# Altium schematic sheet 温度控制.SchDoc
size A3
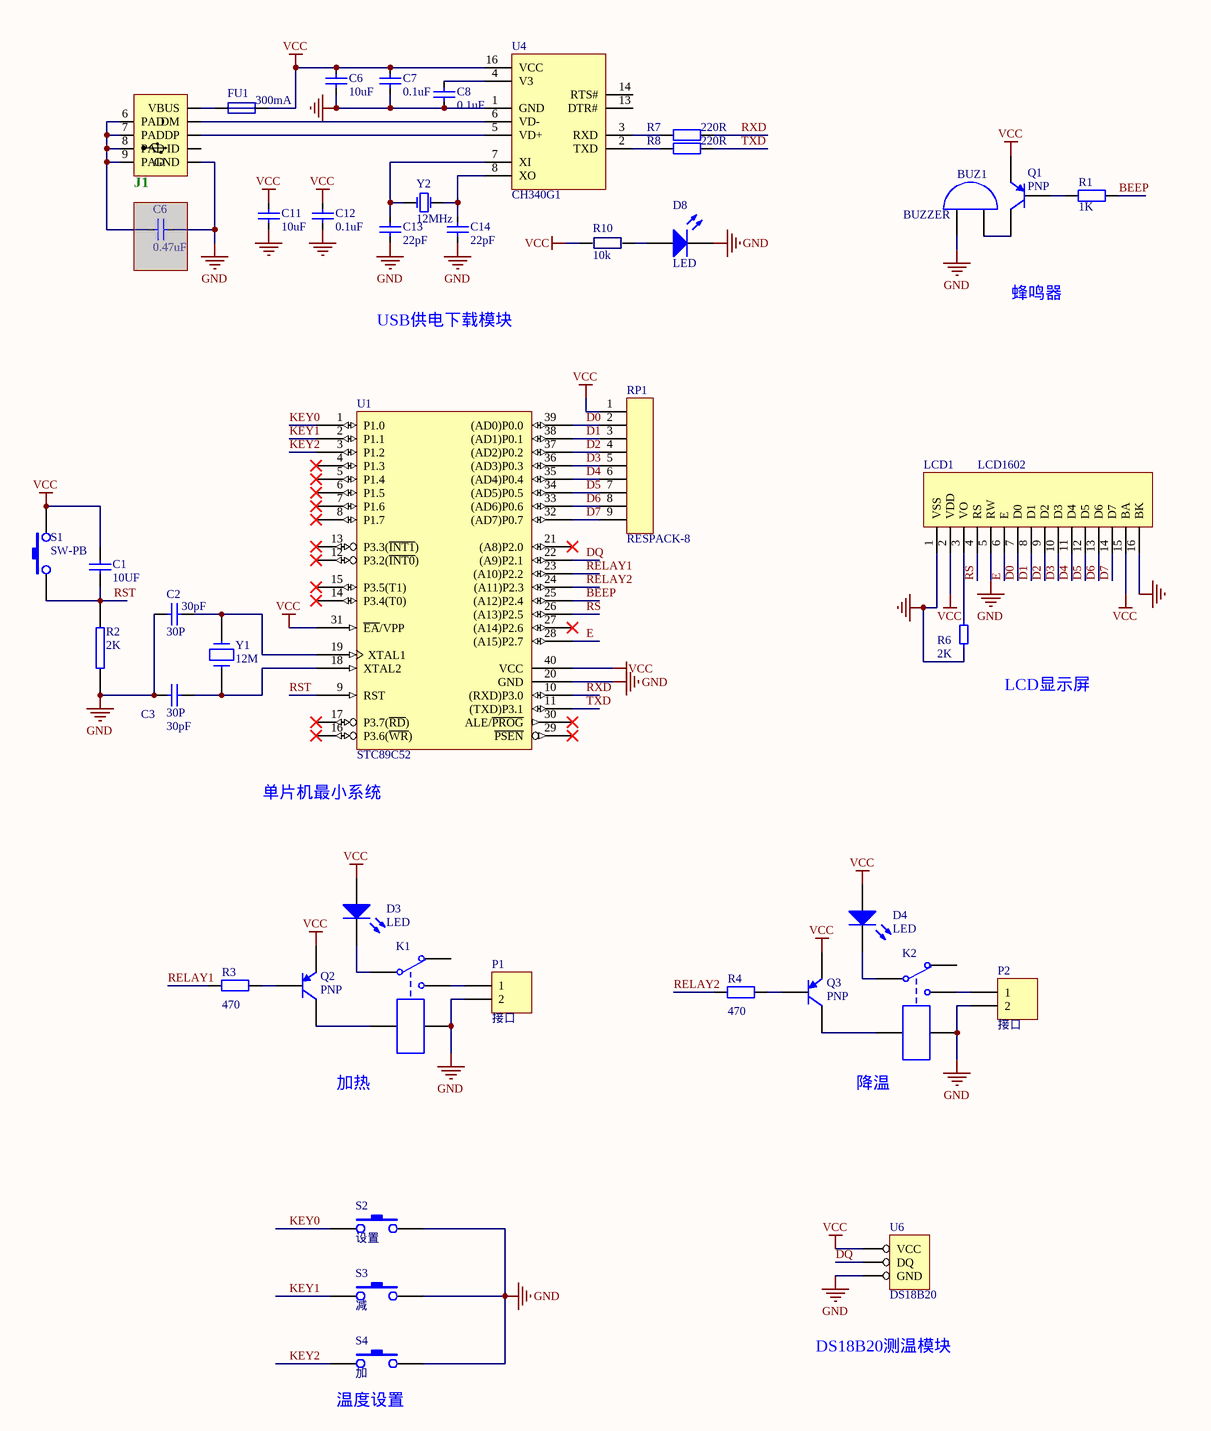
[diagram p0: 温度控制.SchDoc]

## Parts
(Parts that share a designator on the sheet are numbered #1, #2 ... from top to bottom, then left to right.)
BUZ1  BUZZER  [PIN2]
C1  10UF  [FUWEI_DIANRONG]
C2  30P  value 30pF  [VP32-3.2]
C3  30P  value 30pF  [VP32-3.2]
C6#1  value 10uF  [CAP_0805]  (hidden comment: Cap_0805)
C6#2  value 0.47uF  [CAP_0603]  (hidden comment: Cap_0805)  (masked out: inside a compile mask, not in the netlist)
C7  value 0.1uF  [CAP_0603]  (hidden comment: Cap_0805)
C8  value 0.1uF  [CAP_0603]  (hidden comment: Cap_0805)
C11  value 10uF  [CAP_0805]  (hidden comment: Cap_0805)
C12  value 0.1uF  [CAP_0603]  (hidden comment: Cap_0805)
C13  value 22pF  [CAP_0603]  (hidden comment: Cap_0805)
C14  value 22pF  [CAP_0603]  (hidden comment: Cap_0805)
D3  LED  [LED-0]
D4  LED  [LED-0]
D8  LED  [0805D]
FU1  value 300mA  [FUSE_0603]  (hidden comment: Fuse 1)
J1  USB_Micro  [USB_Micro-AB]  (value not drawn)
K1  Relay-SPDT  [MODULE5B]  (value not drawn)
K2  Relay-SPDT  [MODULE5B]  (value not drawn)
LCD1  LCD1602  [HDR1X16]
P1  接口  [HDR1X2]
P2  接口  [HDR1X2]
Q1  PNP  [SOT-23B_N]
Q2  PNP  [SOT-23B_N]
Q3  PNP  [SOT-23B_N]
R1  value 1K  [AXIAL-0.4]  (hidden comment: Res2)
R2  2K  [AXIAL0.3]
R3  value 470  [AXIAL-0.4]  (hidden comment: Res2)
R4  value 470  [AXIAL-0.4]  (hidden comment: Res2)
R6  2K  [AXIAL0.3]
R7  value 220R  [RES_0603]  (hidden comment: Res_0805)
R8  value 220R  [RES_0603]  (hidden comment: Res_0805)
R10  value 10k  [R0805]  (hidden comment: Resistor)
RP1  RESPACK-8  [SIP9]
S1  SW-PB  [ANJIAN]
S2  设置  [ANJIAN]
S3  减  [ANJIAN]
S4  加  [ANJIAN]
U1  STC89C52  [JINSUOZUO]
U4  CH340G1  [SOIC_16]
U6  DS18B20  [POWER]
Y1  12M  [XTAL1]
Y2  12MHz  [XTAL_DIP]

## Nets
GND: BUZ1.1(A) C2.1 C3.1 C6#1.1 C7.1 C8.1 C11.1 C12.1 C13.2 C14.2 D8.2(K) J1.5(GND) K1.5 K2.5 LCD1.1(VSS) LCD1.5(RW) LCD1.16(BK) P1.2 P2.2 R2.1 R6.1 S2.2 S3.2 S4.2 U1.20(GND) U4.1(GND) U6.3(GND) Y2.3(PAD)
VCC: C1.1 C6#1.2 C7.2 C11.2 C12.2 D3.1(A) D4.1(A) FU1.2(IN-) LCD1.2(VDD) LCD1.15(BA) Q1.3(E) Q2.3(E) Q3.3(E) R10.2 RP1.1 S1.2 U1.31(~{EA}/VPP) U1.40(VCC) U4.16(VCC) U6.1(VCC)
BEEP: R1.2 U1.25((A12)P2.4)
D0: LCD1.7(D0) RP1.2 U1.39((AD0)P0.0)
D1: LCD1.8(D1) RP1.3 U1.38((AD1)P0.1)
D2: LCD1.9(D2) RP1.4 U1.37((AD2)P0.2)
D3: LCD1.10(D3) RP1.5 U1.36((AD3)P0.3)
D4: LCD1.11(D4) RP1.6 U1.35((AD4)P0.4)
D5: LCD1.12(D5) RP1.7 U1.34((AD5)P0.5)
D6: LCD1.13(D6) RP1.8 U1.33((AD6)P0.6)
D7: LCD1.14(D7) RP1.9 U1.32((AD7)P0.7)
DQ: U1.22((A9)P2.1) U6.2(DQ)
E: LCD1.6(E) U1.28((A15)P2.7)
KEY0: S2.1 U1.1(P1.0)
KEY1: S3.1 U1.2(P1.1)
KEY2: S4.1 U1.3(P1.2)
RELAY1: R3.1 U1.23((A10)P2.2)
RELAY2: R4.1 U1.24((A11)P2.3)
RS: LCD1.4(RS) U1.26((A13)P2.5)
RST: C1.2 R2.2 S1.1 U1.9(RST)
RXD: R7.1 U1.10((RXD)P3.0)
TXD: R8.1 U1.11((TXD)P3.1)
NetBUZ1_2: BUZ1.2(B) Q1.1(C)
NetC2_2: C2.2 U1.19(XTAL1) Y1.2
NetC3_2: C3.2 U1.18(XTAL2) Y1.1
NetC8_2: C8.2 U4.4(V3)
NetC13_1: C13.1 U4.7(XI) Y2.1(OSC1)
NetC14_1: C14.1 U4.8(XO) Y2.2(OSC2)
NetD3_2: D3.2(K) K1.1
NetD4_2: D4.2(K) K2.1
NetD8_1: D8.1(A) R10.1
NetFU1_1: FU1.1(IN+) J1.1(VBUS)
NetJ1_2: J1.2(DM) U4.6(VD-)
NetJ1_3: J1.3(DP) U4.5(VD+)
NetJ1_6: J1.6(PAD) J1.7(PAD) J1.8(PAD) J1.9(PAD)
NetK1_3: K1.3 P1.1
NetK1_4: K1.4 Q2.1(C)
NetK2_3: K2.3 P2.1
NetK2_4: K2.4 Q3.1(C)
NetLCD1_3: LCD1.3(VO) R6.2
NetQ1_2: Q1.2(B) R1.1
NetQ2_2: Q2.2(B) R3.2
NetQ3_2: Q3.2(B) R4.2
NetR7_2: R7.2 U4.3(RXD)
NetR8_2: R8.2 U4.2(TXD)

Not connected (* = marked no-connect by the designer): J1 4(ID); K1 2; K2 2; U1 4(P1.3)* 5(P1.4)* 6(P1.5)* 7(P1.6)* 8(P1.7)* 12(P3.2(~{INT0}))* 13(P3.3(~{INT1}))* 14(P3.4(T0))* 15(P3.5(T1))* 16(P3.6(~{WR}))* 17(P3.7(~{RD}))* 21((A8)P2.0)* 27((A14)P2.6)* 29(~{PSEN})* 30(ALE/~{PROG})*; U4 13(DTR#) 14(RTS#)

## Notes on the sheet
- 蜂鸣器
- USB供电下载模块
- (near R6) LCD显示屏
- 单片机最小系统
- 加热
- 降温
- DS18B20测温模块
- (near S4) 温度设置

## Library data of the parts
BUZ1 = Bell: Electrical Bell; Published: 24-Mar-1999; LatestRevisionDate: 17-Jul-2002; LatestRevisionNote: Re-released for DXP Platform.; PackageReference: PIN2; Publisher: Altium Limited
C1-C3 = Cap: Capacitor; Published: 8-Jun-2000; LatestRevisionDate: 17-Jul-2002; LatestRevisionNote: Re-released for DXP Platform.; PackageReference: RAD-0.3; Publisher: Altium Limited
  C1: Value: 10UF
C6#1 C6#2 C7 C8 C11-C14 = Cap_0805: Capacitor
D3 D4 = LED0: Typical INFRARED GaAs LED; Published: 8-Jun-2000; LatestRevisionDate: 08-Jul-2005; LatestRevisionNote: Mech Layer 1 removed.; PackageReference: LED-0; Publisher: Altium Limited; PackageDescription: LED; 2 Leads
FU1 = Fuse 1: FUSE,Littelfuse
J1 = USB_Micro: USB
K1 K2 = Relay-SPDT: Single-Pole Dual-Throw Relay; Published: 24-Mar-1999; LatestRevisionDate: 17-Jul-2002; LatestRevisionNote: Re-released for DXP Platform.; PackageReference: MODULE5B; Publisher: Altium Limited
P1 P2 = Header 2: Header, 2-Pin; LatestRevisionDate: 17-Jul-2002; LatestRevisionNote: Re-released for DXP Platform.; Publisher: Altium Limited
Q1-Q3 = PNP: PNP Bipolar Transistor; Published: 8-Jun-2000; LatestRevisionDate: 29-May-2009; LatestRevisionNote: IPC-7351 Footprint Added.; PackageVersion: Aug-1999; PackageReference: SOT-23B; Publisher: Altium Limited; PackageDescription: 3-Pin SOT-23 Package 0.95 mm Pitch, 2.4 mm Lead Span
R1 R3 R4 = Res2: Resistor; Published: 8-Jun-2000; LatestRevisionDate: 17-Jul-2002; LatestRevisionNote: Re-released for DXP Platform.; PackageReference: AXIAL-0.4; Publisher: Altium Limited; PackageDescription: Axial Device, Thru-Hole; 2 Leads; 0.4 in Pin Spacing
R2 R6 = RES2
R7 R8 = Res_0805: Resistor
RP1 = CON9: Connector
S2-S4 = SW-PB
U1 = AT89C51: 8-Bit Microcontroller with 4K Flash ROM
U6 = HEADER 3
Y1 = CRYSTAL
Y2 = XTAL_8.0M: Crystal Oscillator; Published: 8-Jun-2000; LatestRevisionDate: 17-Jul-2002; LatestRevisionNote: Re-released for DXP Platform.; Publisher: Altium Limited